# Altium schematic sheet Light_Monitoring.SchDoc
size A4; SheetNumber: 6; SheetTotal: 11
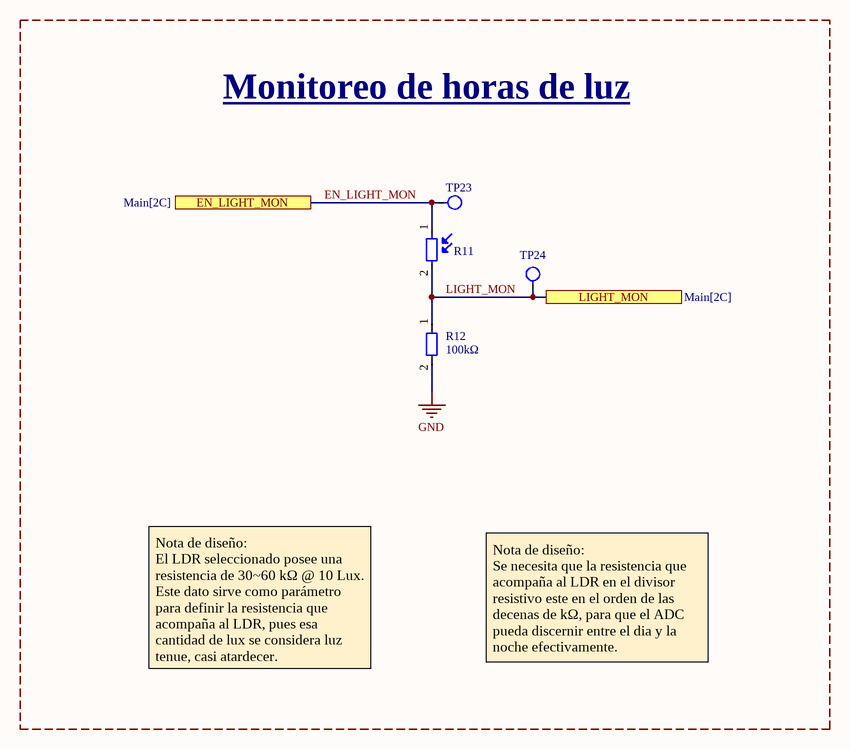
[diagram p0: Light_Monitoring.SchDoc]

## Parts
R11  LDR  [Generic LDR]  (value not drawn)
R12  value 100kΩ  [RES_0603]  (hidden comment: 100k)
TP23  Testpoint SMD  [Testpoint_SMD]  (value not drawn)  (no BOM)
TP24  Testpoint SMD  [Testpoint_SMD]  (value not drawn)  (no BOM)

## Blocks framed on the sheet
Monitoreo de horas de luz: R11 R12 TP23 TP24

## Ports
EN_LIGHT_MON (see Main[2C]), LIGHT_MON (see Main[2C])

## Nets
GND: R12.2
EN_LIGHT_MON: R11.1 TP23.1 ; port EN_LIGHT_MON
LIGHT_MON: R11.2 R12.1 TP24.1 ; port LIGHT_MON

## Notes on the sheet
- Nota de diseño:
  El LDR seleccionado posee una resistencia de 30~60 kΩ @ 10 Lux. Este dato sirve como parámetro para definir la resistencia que acompaña al LDR, pues esa cantidad de lux se considera luz tenue, casi atardecer.
- Nota de diseño:
  Se necesita que la resistencia que acompaña al LDR en el divisor resistivo este en el orden de las decenas de kΩ, para que el ADC pueda discernir entre el dia y la noche efectivamente.

## Library data of the parts
R11 = Generic LDR: LDR for sensing daylight hours.; Light Resistance: 10kΩ; Dark Resistance: 1MΩ; Spectral Response Range: 400-700nm; Diameter: 5mm
R12 = Generic R: RES  100k 1% 0603
TP23 TP24 = Testpoint_SMD: Testpoint SMD de 1mm de diametro.